# EAGLE schematic schematic_base_board (EAGLE 7.2.0)
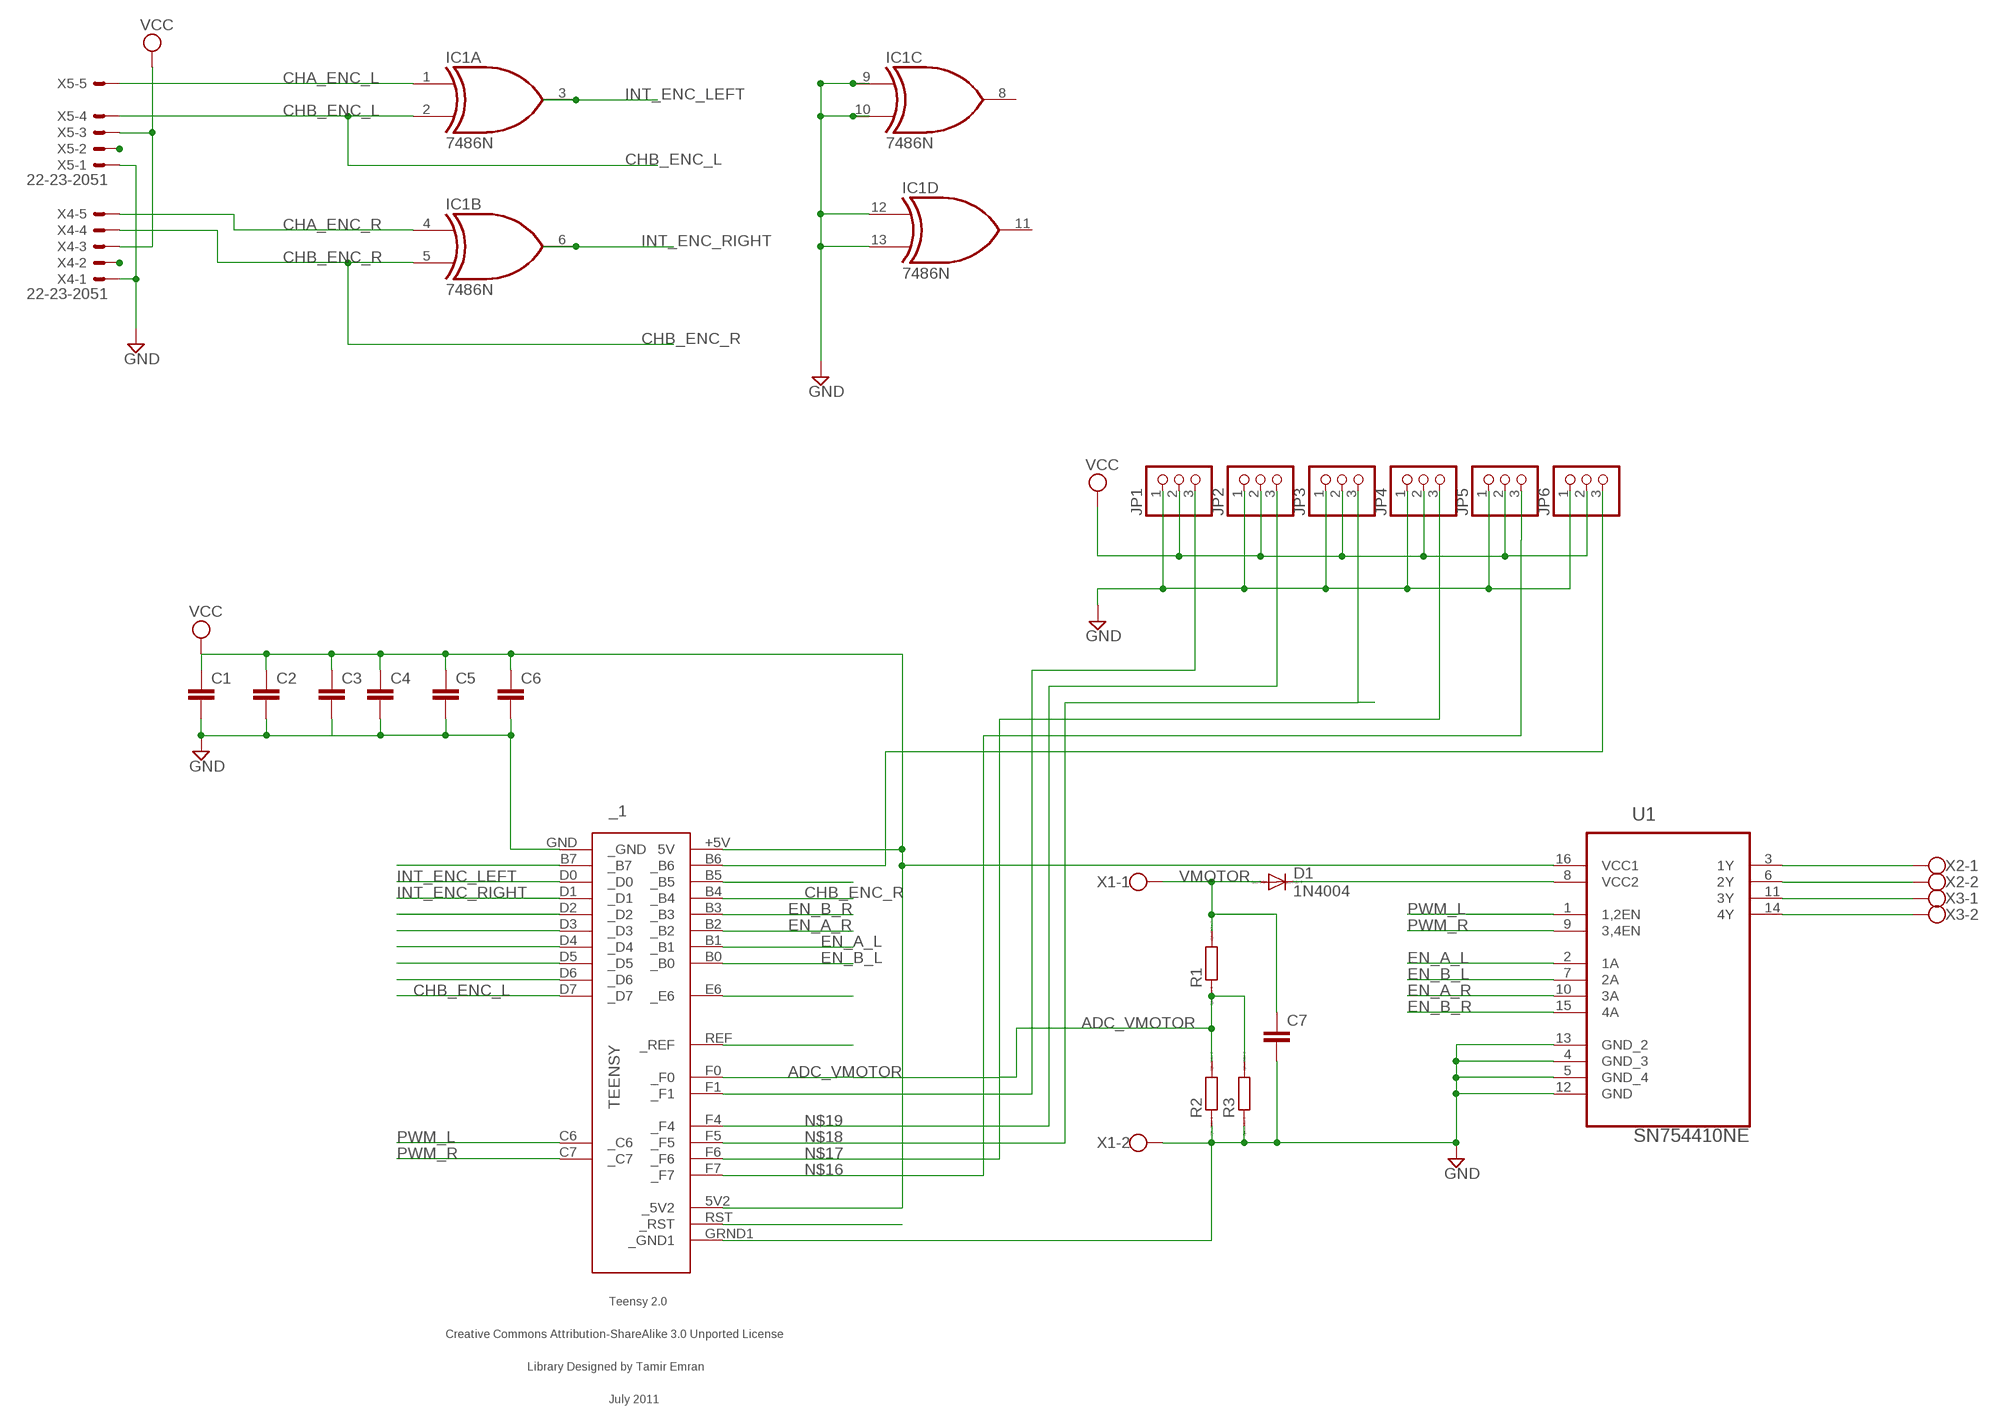
[diagram p0: schematic, sheet 1]

## Parts
_1  TEENSY  [TEENSY]
C1  C2.5/2  [C2.5-2]
C2  C2.5/2  [C2.5-2]
C3  C2.5/2  [C2.5-2]
C4  C2.5/2  [C2.5-2]
C5  C2.5/2  [C2.5-2]
C6  C2.5/2  [C2.5-2]
C7  C5/4.5  [C5B4.5]
D1  1N4004  [DO41-10]
IC1  7486N  [DIL14]
JP1  PINHD-1X3  [1X03]
JP2  PINHD-1X3  [1X03]
JP3  PINHD-1X3  [1X03]
JP4  PINHD-1X3  [1X03]
JP5  PINHD-1X3  [1X03]
JP6  PINHD-1X3  [1X03]
R1  R0207/10  [0207/10]
R2  R0207/10  [0207/10]
R3  R0207/10  [0207/10]
U1  SN754410NE  [DIP254P762X508-16]
X1  W237-102  [W237-102]
X2  W237-102  [W237-102]
X3  W237-102  [W237-102]
X4  22-23-2051  [22-23-2051]
X5  22-23-2051  [22-23-2051]

## Nets
ADC_VMOTOR: _1.F0(_F0) R1.1 R2.2 R3.2
CHA_ENC_L: IC1.1(A:I0) X5.5
CHA_ENC_R: IC1.4(B:I0) X4.5
CHB_ENC_L: _1.D7(_D7) IC1.2(A:I1) X5.4
CHB_ENC_R: _1.B4(_B4) IC1.5(B:I1) X4.4
EN_A_L: _1.B1(_B1) U1.2(1A)
EN_A_R: _1.B2(_B2) U1.10(3A)
EN_B_L: _1.B0(_B0) U1.7(2A)
EN_B_R: _1.B3(_B3) U1.15(4A)
GND: _1.GND(_GND) _1.GRND1(_GND1) C1.2 C2.2 C3.2 C4.2 C5.2 C6.2 C7.2 IC1.9(C:I0) IC1.10(C:I1) IC1.12(D:I0) IC1.13(D:I1) JP1.1 JP2.1 JP3.1 JP4.1 JP5.1 JP6.1 R2.1 R3.1 U1.4(GND_3) U1.5(GND_4) U1.12(GND) U1.13(GND_2) X1.2 X4.1 X5.1
INT_ENC_LEFT: _1.D0(_D0) IC1.3(A:O)
INT_ENC_RIGHT: _1.D1(_D1) IC1.6(B:O)
N$1: X4.2
N$2: D1.C U1.8(VCC2)
N$6: _1.D2(_D2)
N$7: _1.D3(_D3)
N$8: _1.D4(_D4)
N$9: _1.D5(_D5)
N$10: _1.D6(_D6)
N$14: _1.RST(_RST)
N$15: X5.2
N$16: _1.F7(_F7) JP5.3
N$17: _1.F6(_F6) JP4.3
N$18: _1.F5(_F5) JP3.3
N$19: _1.F4(_F4) JP2.3
N$20: _1.F1(_F1) JP1.3
N$22: _1.REF(_REF)
N$23: _1.E6(_E6)
N$29: _1.B5(_B5)
N$30: _1.B6(_B6) JP6.3
N$36: U1.3(1Y) X2.1
N$37: U1.6(2Y) X2.2
N$38: U1.11(3Y) X3.1
N$39: U1.14(4Y) X3.2
PB7: _1.B7(_B7)
PWM_L: _1.C6(_C6) U1.1(1,2EN)
PWM_R: _1.C7(_C7) U1.9(3,4EN)
VCC: _1.5V2(_5V2) _1.+5V(5V) C1.1 C2.1 C3.1 C4.1 C5.1 C6.1 JP1.2 JP2.2 JP3.2 JP4.2 JP5.2 JP6.2 U1.16(VCC1) X4.3 X5.3
VMOTOR: C7.1 D1.A R1.2 X1.1
Unconnected: IC1.8(C:O) IC1.11(D:O)

## Power pins joined to a net without a drawn wire
GND: IC1.7(P:GND)
VCC: IC1.14(P:VCC)

## Library data of the parts
_1 = teensy:TEENSY: Teensy 2.0 Original Design by Clint Fisher Modified Design by Tamir Emran Licensed Under Creative Commons Attribution-ShareAlike 3.0 Unported (CC BY-SA 3.0)
C1-C7 = capacitor-wima:C: CAPACITOR naming: grid - package width
D1 = diode:1N4004: DIODE general purpose rectifier, 1 A
IC1 = 74xx-us:74*86: Quad 2-input EXCLUSIV-OR (XOR) gate
JP1-JP6 = pinhead:PINHD-1X3: PIN HEADER
R1-R3 = eagle-ltspice:R: RESISTOR, European symbol; SPICEMODEL: NONE; SPICEPREFIX: R
U1 = Texas Instruments_By_element14_Batch_1:SN754410NE: QUADRUPLE HALF-H DRIVERS; MPN: SN754410NE; OC_FARNELL: 1470411; OC_NEWARK: 08F8145; PACKAGE: PDIP-16; SUPPLIER: Texas Instruments
X1-X3 = con-wago-500:W237-102: WAGO SCREW CLAMP; MPN: 237-102; OC_FARNELL: unknown; OC_NEWARK: 70K9898
X4 X5 = con-molex:22-23-2051: .100" (2.54mm) Center Header - 5 Pin; MF: MOLEX; MPN: 22-23-2051; OC_FARNELL: 1462952; OC_NEWARK: 38C9178